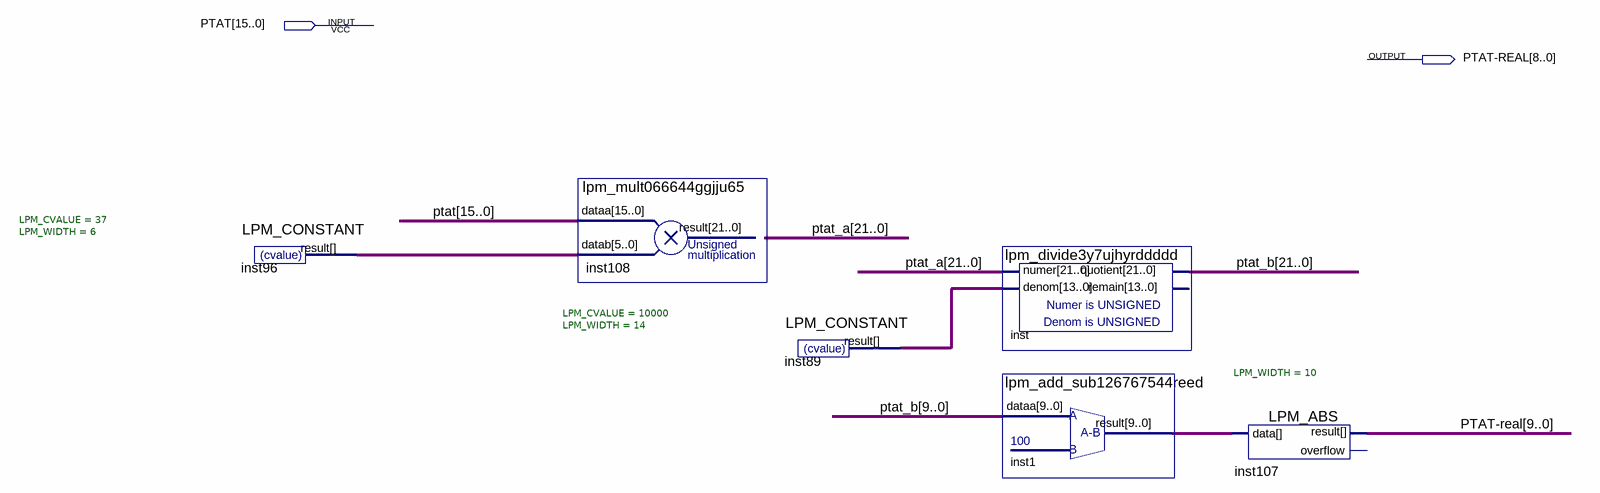
[diagram p0: schematic sheet]
// Quartus schematic PTAT.bdf as structural Verilog: 6 symbols, 2 pins
module PTAT (
  input  [15:0] PTAT,
  output [9:0] \PTAT-REAL 
);

  wire [5:0] inst96_result;
  wire [9:0] inst1_result;
  wire [13:0] inst89_result;
  wire [21:0] ptat_a, ptat_b;

  LPM_CONSTANT #(.LPM_CVALUE(37), .LPM_WIDTH(6)) inst96 (.result(inst96_result));
  lpm_mult066644ggjju65 inst108 (.dataa(PTAT), .datab(inst96_result), .result(ptat_a));
  LPM_CONSTANT #(.LPM_CVALUE(10000), .LPM_WIDTH(14)) inst89 (.result(inst89_result));
  lpm_divide3y7ujhyrddddd inst (.numer(ptat_a), .denom(inst89_result), .quotient(ptat_b));  // open: remain
  lpm_add_sub126767544reed inst1 (.dataa(ptat_b[9:0]), .result(inst1_result));
  LPM_ABS #(.LPM_WIDTH(10)) inst107 (.data(inst1_result), .result(\PTAT-REAL ));  // open: overflow
endmodule
